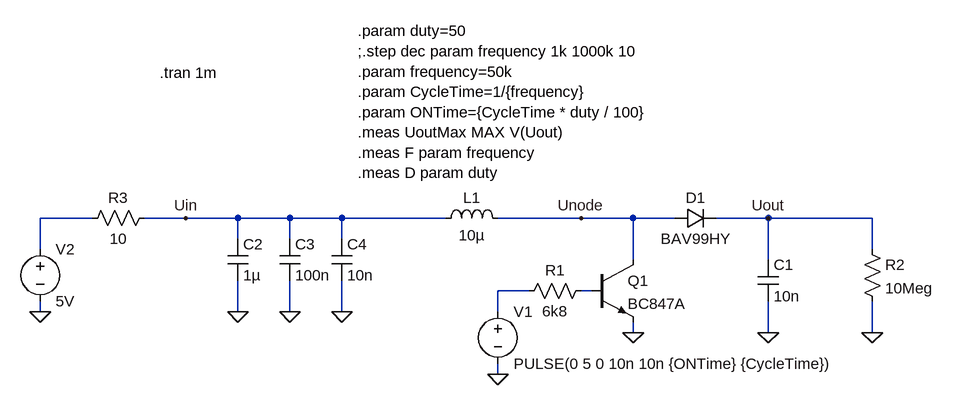
[diagram p0: schematic BoostConverter.asc]
BoostConverter.asc, the LTspice schematic file:
Version 4
SHEET 1 2816 680
WIRE -1152 -1168 -1232 -1168
WIRE -1008 -1168 -1072 -1168
WIRE -928 -1168 -1008 -1168
WIRE -848 -1168 -928 -1168
WIRE -768 -1168 -848 -1168
WIRE -608 -1168 -768 -1168
WIRE -400 -1168 -528 -1168
WIRE -320 -1168 -400 -1168
WIRE -256 -1168 -320 -1168
WIRE -112 -1168 -192 -1168
WIRE 48 -1168 -112 -1168
WIRE -928 -1136 -928 -1168
WIRE -848 -1136 -848 -1168
WIRE -768 -1136 -768 -1168
WIRE -1232 -1120 -1232 -1168
WIRE 48 -1120 48 -1168
WIRE -320 -1104 -320 -1168
WIRE -112 -1104 -112 -1168
WIRE -480 -1056 -528 -1056
WIRE -384 -1056 -400 -1056
WIRE -1232 -1024 -1232 -1040
WIRE -928 -1024 -928 -1072
WIRE -848 -1024 -848 -1072
WIRE -768 -1024 -768 -1072
WIRE -528 -1024 -528 -1056
WIRE -320 -992 -320 -1008
WIRE -112 -992 -112 -1040
WIRE 48 -992 48 -1040
WIRE -528 -928 -528 -944
FLAG -528 -928 0
FLAG -1232 -1024 0
FLAG -320 -992 0
FLAG -112 -992 0
FLAG -112 -1168 Uout
FLAG -400 -1168 Unode
FLAG -928 -1024 0
FLAG -1008 -1168 Uin
FLAG -848 -1024 0
FLAG -768 -1024 0
FLAG 48 -992 0
SYMBOL voltage -528 -1040 R0
WINDOW 123 0 0 Left 0
WINDOW 39 0 0 Left 0
SYMATTR InstName V1
SYMATTR Value PULSE(0 5 0 10n 10n {ONTime} {CycleTime})
SYMBOL ind -624 -1152 R270
WINDOW 0 32 56 VTop 2
WINDOW 3 5 56 VBottom 2
SYMATTR InstName L1
SYMATTR Value 10µ
SYMBOL voltage -1232 -1136 R0
WINDOW 123 0 0 Left 0
WINDOW 39 0 0 Left 0
SYMATTR InstName V2
SYMATTR Value 5V
SYMBOL npn -384 -1104 R0
SYMATTR InstName Q1
SYMATTR Value BC847A
SYMBOL res -384 -1072 R90
WINDOW 0 0 56 VBottom 2
WINDOW 3 32 56 VTop 2
SYMATTR InstName R1
SYMATTR Value 6k8
SYMBOL diode -256 -1152 R270
WINDOW 0 32 32 VTop 2
WINDOW 3 0 32 VBottom 2
SYMATTR InstName D1
SYMATTR Value BAV99HY
SYMBOL cap -128 -1104 R0
SYMATTR InstName C1
SYMATTR Value 10n
SYMBOL cap -944 -1136 R0
SYMATTR InstName C2
SYMATTR Value 1µ
SYMBOL res -1056 -1184 R90
WINDOW 0 0 56 VBottom 2
WINDOW 3 32 56 VTop 2
SYMATTR InstName R3
SYMATTR Value 10
SYMBOL cap -864 -1136 R0
SYMATTR InstName C3
SYMATTR Value 100n
SYMBOL cap -784 -1136 R0
SYMATTR InstName C4
SYMATTR Value 10n
SYMBOL res 32 -1136 R0
SYMATTR InstName R2
SYMATTR Value 10Meg
TEXT -1048 -1392 Left 2 !.tran 1m
TEXT -744 -1456 Left 2 !.param duty=50\n;.step dec param frequency 1k 1000k 10\n.param frequency=50k\n.param CycleTime=1/{frequency}\n.param ONTime={CycleTime * duty / 100}\n.meas UoutMax MAX V(Uout)\n.meas F param frequency\n.meas D param duty

The netlist it stands for:
* BoostConverter.asc
V1 N002 0 PULSE(0 5 0 10n 10n {ONTime} {CycleTime})
L1 Uin Unode 10µ
V2 N001 0 5V
Q1 Unode N003 0 0 BC847A
R1 N003 N002 6k8
D1 Unode Uout BAV99HY
C1 Uout 0 10n
C2 Uin 0 1µ
R3 Uin N001 10
C3 Uin 0 100n
C4 Uin 0 10n
R2 Uout 0 10Meg
.model D D
.lib standard.dio
.model NPN NPN
.model PNP PNP
.lib standard.bjt
.tran 1m
.param duty=50
;.step dec param frequency 1k 1000k 10
.param frequency=50k
.param CycleTime=1/{frequency}
.param ONTime={CycleTime * duty / 100}
.meas UoutMax MAX V(Uout)
.meas F param frequency
.meas D param duty
.backanno
.end